# Altium schematic sheet IO.SchDoc: IO
size A4; Date: 31 08 2013; Author: Rachid AKKOUCHE; CompanyName: MDI; DrawnBy: Rachid AKKOUCHE; Engineer: Rachid AKKOUCHE; Organization: RASoftware; Address1: 52 J03, rue de la crèche; Address2: 77100 MEAUX; Address3: FRANCE; DocumentNumber: BRA2013090103C3; Revision: C; SheetNumber: 3; SheetTotal: 4; Telephone: +33651604047; Email: rachid.akkouche@wanadoo.fr; Dessinepar: -; Verifiepar: -; Property: RASoftware; PageSetup: Record=PageOptions|CenterHorizontal=True|CenterVertical=True|PrintScale=0.88|XCorrection=1.00|YCorrection=1.00|PrintKind=0|BorderSize=5000000|LeftOffset=0|BottomOffset=0|Orientation=2|PaperLength=1000|PaperWidth=1000|Scale=100|PaperSource=7|PrintQuality=-3|MediaType=1|DitherType=10|PrintScaleMode=1|PaperKind=16K|PaperIndex=409; Time: 13:22
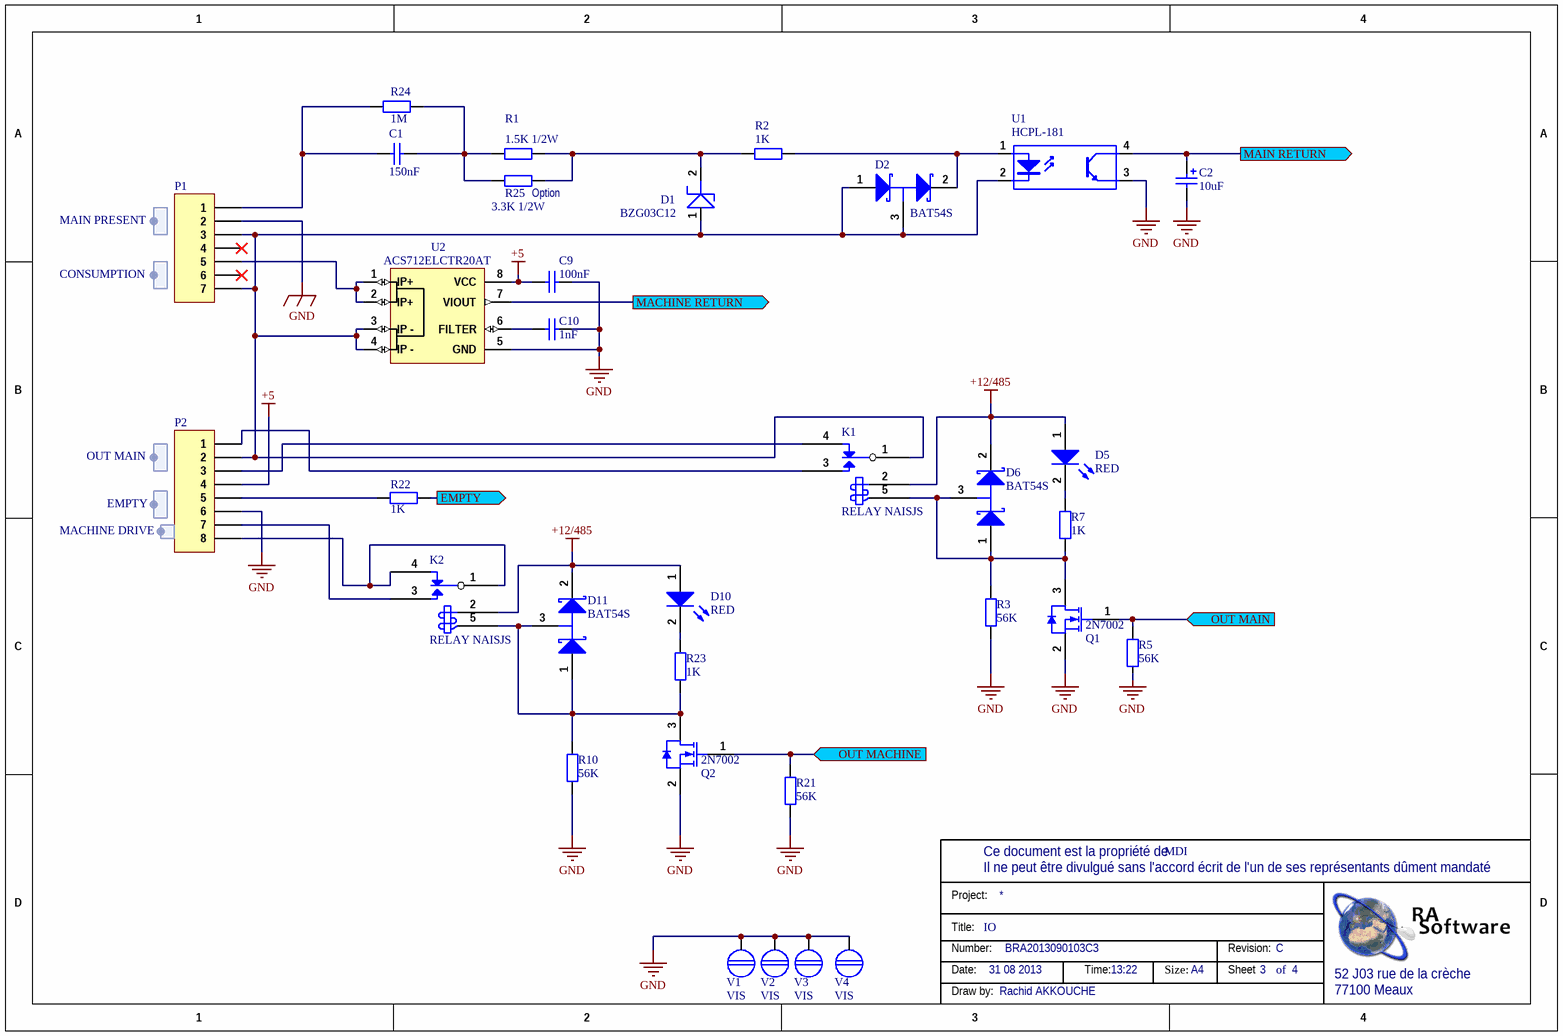
[diagram p0: IO.SchDoc]

## Parts
C1  150nF  [C1210]
C2  10uF  [C0805]
C9  100nF  [C0805]
C10  1nF  [C0805]
D1  BZG03C12  [sma]
D2  BAT54S  [SOT23]
D5  Couleur: RED  [0603-LEDR]  (hidden comment: HSMH-C190)
D6  BAT54S  [SOT23]
D10  Couleur: RED  [0603-LEDR]  (hidden comment: HSMH-C190)
D11  BAT54S  [SOT23]
K1  RELAY NAISJS  [RELAIG5L]
K2  RELAY NAISJS  [RELAIG5L]
P1  Header 7  [CO7P508-90]  (value not drawn)
P2  Header 8  [CO8P508 - 90°]  (value not drawn)
Q1  2N7002  [SOT23]
Q2  2N7002  [SOT23]
R1  1.5K 1/2W  [R1206]
R2  1K  [R0805]
R3  56K  [R0805]
R5  56K  [R0805]
R7  1K  [R0805]
R10  56K  [R0805]
R21  56K  [R0805]
R22  1K  [R0805]
R23  1K  [R0805]
R24  1M  [R0805]
R25  3.3K 1/2W  [R1206]  (no BOM)
U1  HCPL-181  [OPTO-4PIN]
U2  Supplier Part Number 1: ACS712ELCTR20AT  [SOIC8]  (hidden comment: ACS712)
V1  VIS  [vis42]
V2  VIS  [vis42]
V3  VIS  [vis42]
V4  VIS  [vis42]

## Ports
EMPTY (out), MACHINE RETURN (out), MAIN RETURN (out), OUT MACHINE (in), OUT MAIN (in)

## Harnesses
?: 

## Nets
+5: C9.2 P2.4 U2.8(VCC)
+12/485: D5.1(A) D6.2(K) D10.1(A) D11.2(K) K1.2(COIL1) K2.2(COIL1)
GND: C2.2 C9.1 C10.2 P1.2 P2.6 Q1.2(S) Q2.2(S) R3.1 R5.1 R10.1 R21.1 U1.3(E) U2.5(GND) V1.1 V2.1 V3.1 V4.1
EMPTY: R22.1 ; port EMPTY
MACHINE RETURN: U2.7(VIOUT) ; port MACHINE RETURN
MAIN RETURN: C2.1 U1.4(C) ; port MAIN RETURN
OUT MACHINE: Q2.1(G) R21.2 ; port OUT MACHINE
OUT MAIN: Q1.1(G) R5.2 ; port OUT MAIN
NetC1_1: C1.1 P1.1 R24.2
NetC1_2: C1.2 R1.2 R24.1 R25.2
NetC10_1: C10.1 U2.6(FILTER)
NetD1_1: D1.1 D2.1(A) D2.3(C) K1.1(COMMON) P1.3 P1.7 P2.2 U1.2(K) U2.3(IP_-) U2.4(IP_-)
NetD1_2: D1.2 R1.1 R2.1 R25.1
NetD2_2: D2.2(K) R2.2 U1.1(A)
NetD5_2: D5.2(K) R7.2
NetD6_1: D6.1(A) D6.3(C) K1.5(COIL2) Q1.3(D) R3.2 R7.1
NetD10_2: D10.2(K) R23.2
NetD11_1: D11.1(A) D11.3(C) K2.5(COIL2) Q2.3(D) R10.2 R23.1
NetK1_3: K1.3(NO) P2.1
NetK1_4: K1.4(NC) P2.3
NetK2_1: K2.1(COMMON) K2.4(NC) P2.8
NetK2_3: K2.3(NO) P2.7
NetP1_5: P1.5 U2.1(IP+) U2.2(IP+)
NetP2_5: P2.5 R22.2

Not connected (* = marked no-connect by the designer): P1 4* 6*

## Notes on the sheet
- MAIN PRESENT
- (near R25) Option
- CONSUMPTION
- OUT MAIN
- EMPTY
- MACHINE DRIVE
- Ce document est la propriété de
- Project:
- Il ne peut être divulgué sans l'accord écrit de l'un de ses représentants dûment mandaté
- Title:
- Number:
- Date:
- Time:
- Size:
- A4
- Revision:
- Sheet
- of
- 52 J03 rue de la crèche
- Draw by:
- 77100 Meaux

## Library data of the parts
C1 = Cap: Capacitor; Manufacturer: KEMET; Manufacturer Part Number: C1210V154KCRACTU; Gamme de produit: KEMET - ArcShield V Series; Capacité: 0.15; Tolérance de capacité: ± 10%; Diélectrique: X7; Tension: 500; Boîtier de condensateur Céramique: 1210 [3225 Metric]; Température d'utilisation min: -55; Température de fonctionnement max..: 125; Type de packaging: Bande découpée; SVHC: No SVHC (16-Dec-2013); Bornes de condensateur: CMS; Température de fonctionnement: -55°C à +125; Type de boîtier de condensateur: 1210 [3225 Metric]<!--FANDB--><div class="features-and-benefits-container"></div>; Supplier 1: Farnell; Supplier Part Number 1: 2085200; RoHS: YES; Pricing 1: 10=0,34, 50=0,28, 100=0,154, 500=0,125, 2500=0,097 (EUR); MSL: MSL 1 - Illimité; Tolérance de capacité ±: ± 10%; ComponentLink1URL: http://www.farnell.com/datasheets/1698777.pdf; ComponentLink1Description: http://www.farnell.com/datasheets/1698777.pdf
C2 = Cap Pol 100uF: Polarized Capacitor; Manufacturer: EPCOS; Manufacturer Part Number: B41142A4107M; Product Range: EPCOS - B41142 Series; Capacité: 100; Tolérance de capacité: ± 20%; Tension: 16; Type de boîtier de condensateur: Radial Can - SMD; Diamètre: 6.3; Résistance, ESR: 0.16; Hauteur: 7.7; Courant d'ondulation c.a.: 300; Type de packaging: Cut Tape; Durée de vie @ température: 2000 heures @ 105; Température d'utilisation min: -55; Température de fonctionnement max..: 105; SVHC: No SVHC (19-Dec-2012); Impédance: 0.26; Température de fonctionnement: -55°C à +105; Température, ESR: 20; Type de boîtier: CMS; Supplier 1: Farnell; RoHS: YES; Pricing 1: 10=0,123, 50=0,095, 100=0,078, 250=0,07, 1000=0,062 (EUR); Courant d'ondulation c.a. à  100Hz: 300; Fréquence, impédance: 100; Longueur/hauteur: 7.7; Température, courant ondulatoire: 105; Température, impédance: 20; ComponentLink1URL: http://www.epcos.com/inf/20/30/db/alu_x/B41142.pdf; ComponentLink1Description: http://www.epcos.com/inf/20/30/db/alu_x/B41142.pdf; Supplier Part Number 1: 1735328
C9 = Cap 0805 100nF: Capacitor; Manufacturer: MULTICOMP; Manufacturer Part Number: MCCA000296; Supplier 1: Farnell; Supplier Part Number 1: 1759167; Pricing 1: 100=0,01, 500=0,008, 1000=0,006, 4000=0,005 (EUR); ComponentLink1URL: http://www.farnell.com/datasheets/1520827.pdf; ComponentLink1Description: http://www.farnell.com/datasheets/1520827.pdf
C10 = Cap 0805 1nF: Capacitor; Manufacturer: SAMSUNG; Manufacturer Part Number: CL05B102KB5NNNC; Unit: pcs; SuppliedAmount: 10000; MinAmount: 300; Multiples: 100; Type de condensateur: céramique; Tye de condensateur: MLCC; Tension de travail: 50V; Diélectrique: X7R; Tolérance: ±10%; Montage: SMD; Boîtier: 0402; Température de travail: -55...125°C; Supplier 1: TME; Category: Condensateurs MLCC SMD 0402; Stock 1: 25000; Pricing 1: 300=0,00208, 1000=0,00124, 10000=0,00069, 40000=0,00066, 100000=0,00064 (EUR); Weight: 0,012; Price Type: NET; Capacité: 1nF; Fabricant: SAMSUNG; ComponentLink1URL: http://www.tme.eu/fr/details/cl05b102kb5nnnc/condensateurs-mlcc-smd-0402/samsung/; ComponentLink1Description: http://www.tme.eu/fr/details/cl05b102kb5nnnc/condensateurs-mlcc-smd-0402/samsung/; Supplier Part Number 1: CL05B102KB5NNNC
D1 = DZ: Manufacturer: VISHAY; Manufacturer Part Number: BZG03C12TR3; Supplier 1: Farnell; Supplier Part Number 1: 9398090; RoHS: YES; Pricing 1: 5=0,62, 100=0,37, 1500=0,26, 3000=0,138, 7000=0,135, 30000=0,132, 30000=0,129 (EUR); ComponentLink1URL: http://www.farnell.com/datasheets/69906.pdf; ComponentLink1Description: http://www.farnell.com/datasheets/69906.pdf
D2 D6 D11 = BAT54S: Schottky Barrier Double Diode; Manufacturer: MULTICOMP; Courant, If moy.: 200; Tension, Vrrm: 30; Tension, Vf max..: 400; Temps trr max.: 5; Courant, Ifs max.: 600; Type de boîtier diode: SOT-23; Nombre de broches: 3; SVHC: No SVHC (19-Dec-2012); Configuration diode: Dual Series; Température, Tj max..: 150; Type de terminaison: SMD; Température d'utilisation min: -55; Courant, If, Vf: 10; Courant, Ir, max..: 2; Marquage, CMS: L44; Température de fonctionnement: -55°C à +150; Supplier 1: Farnell; Supplier Part Number 1: 1621835; Manufacturer Part Number: BAT54S; RoHS: YES; Stock 1: 52055; Pricing 1: 10=0,102, 250=0,074, 1000=0,06, 3000=0,053 (EUR); Diode Type: Schottky; Type de boîtier: SOT-23; courant Ifsm: 600; ComponentLink1URL: http://www.farnell.com/datasheets/1317753.pdf; ComponentLink1Description: http://www.farnell.com/datasheets/1317753.pdf; Température de fonctionnement max..: 150
D5 D10 = HSMH-C190: Surface Mount Chip LED, Red; Manufacturer: AVAGO TECHNOLOGIES; Manufacturer Part Number: HSMH-C190.; Taille de lampe: 0.8mm x 1; Couleur de LED: Rouge; Intensité lumineuse: 17; Angle, vision: 170°; Courant, direct, If: 20; Tension, direct à  If: 1.8; Montage LED: CMS; Forme de lentille: Rectangulaire; Longueur d'onde typ.: 626; SVHC: No SVHC (19-Dec-2012); Dissipation de puissance: 65; Intensité lumineuse min. à  If: 2.8; Intensité lumineuse typique: 10; Largeur (externe): 0.8; Longueur d'onde dominante: 639; Longueur d'onde, crête: 630; Longueur/hauteur: 1.6; Matière: AlGaAs; Nombre de broches: 2; Orientation de montage opto: Dessus; Orientation sortie de lumière: Top Emitting; Température de fonctionnement: -30°C à +85; Température de fonctionnement max..: 85; Température, stockage min.: -40; Température d'utilisation min: -30; Tension, Vf max..: 2.6; Tension, Vf min.: 2.1; Type de LED: Standard; Supplier 1: Farnell; Supplier Part Number 1: 8554641; RoHS: YES; Pricing 1: 5=0,06, 25=0,059, 100=0,057, 250=0,052, 500=0,047 (EUR); MSL: MSL 2A - 4 semaines; Couleur, LED: Rouge; Profondeur: 0.8; Température, stockage max..: 85; Tension, Vf typ.: 1.8; ComponentLink1URL: http://www.farnell.com/datasheets/313031.pdf; ComponentLink1Description: http://www.farnell.com/datasheets/313031.pdf; ComponentLink2URL: http://www.farnell.com/datasheets/55927.pdf; ComponentLink2Description: http://www.farnell.com/datasheets/55927.pdf
K1 K2 = RELAY NAISJS: Manufacturer: OMRON ELECTRONIC COMPONENTS; Manufacturer Part Number: G5LA1A412DC; Type de relais: Puissance; Tension, bobine c.c. nom.: 12; Courant de contact max..: 10; Tension AC nominale du contact: 250; Tension DC nominale du contact: 24; Résistance, bobine: 400; Configuration des contacts: SPST-NO; Type de bobine: CC; Courant de bobine: 30; Puissance de fonctionnement nominale: 360; Montage relais: Traversant; Largeur (externe): 15.8; Profondeur: 19.8; SVHC: No SVHC (20-Jun-2013); Supplier 1: Farnell; Supplier Part Number 1: 2213790; RoHS: YES; Pricing 1: 1=0,84, 10=0,74, 50=0,66, 100=0,59, 250=0,54 (EUR); Hauteur, dimension externe: 15.8; ComponentLink1URL: http://www.farnell.com/datasheets/1648381.pdf; ComponentLink1Description: http://www.farnell.com/datasheets/1648381.pdf
P1 = Header 7: Header, 7-Pin; Manufacturer: FCI; Manufacturer Part Number: 20020110-H071A01LF; Anschlussart: Löten; Anzahl der Kontakte: 7; Anzahl der Reihen: 1; Betriebsspannung: 300 V ac; Breite: 12mm; Farbe: Grün; Gehäuseausrichtung: Rechtwinklig; Gender: Male; Länge: 37.56mm; Montagetyp: Durchsteckmontage; Nennstrom: 12A; Raster: 5.08mm; Serie: 06-508; Tiefe: 8.5mm; Typ: Stiftsockel; Currency: ÿNILÿ; Product StockNumber: 707-5477; Connecteur femelle: 790-0714; LatestRevisionDate: 17-Jul-2002; LatestRevisionNote: Re-released for DXP Platform.; Publisher: Altium Limited; Supplier 1: RS-Components; Supplier Part Number 1: 707-5477; RoHS: Compliant; Category: Steckverbinder; Stock 1: 0; Pricing 1: 5=0,778, 375=0,682, 1250=0,584, 2500=0,486, 5000=0,39 (ÿNILÿ); Material: Nylon; Product Status: ÿNILÿ; Future Stock Date: ÿNILÿ
P2 = Header 8: Header, 8-Pin; Manufacturer: CAMDENBOSS; Manufacturer Part Number: CTB9350/8AO; Gamme de produit: CAMDENBOSS - CTB9350; Type de terminaison de contact: Traversant; Genre: Mâle; Nombre de contacts: 8; Nombre de rangées: 1; Pas: 5; Plaquage du contact: Cuivre; Matériau du contact: Laiton; SVHC: No SVHC (16-Jun-2014); Couleur: vert; Courant: 12; Inflammabilité: UL94V-0; Matériau, vis: Acier; Méthode de terminaison: A souder; Taille du filetage: M3; Température de fonctionnement max..: 125; Température d'utilisation min: -20; Tension nominale Vac: 380; Terminaison du contact: Traversant à angle droit<!--FANDB--><div class="features-and-benefits-container"></div>; Connecteur femelle: 3881891; LatestRevisionDate: 17-Jul-2002; LatestRevisionNote: Re-released for DXP Platform.; Publisher: Altium Limited; Supplier 1: Farnell; Supplier Part Number 1: 3882251; RoHS: YES; Pricing 1: 1=0,963, 25=0,847, 100=0,793, 250=0,732, 700=0,659, 3000=0,581, 3000=0,523, 20000=0,471 (EUR); ComponentLink1URL: http://www.farnell.com/datasheets/1708040.pdf; ComponentLink1Description: http://www.farnell.com/datasheets/1708040.pdf
Q1 Q2 = 2N7002: N-channel Enhancement Mode Field-effect Transistor; Manufacturer: FAIRCHILD SEMICONDUCTOR; Supplier 1: Farnell; Supplier Part Number 1: 9845313; Manufacturer Part Number: 2N7002; RoHS: YES; Pricing 1: 5=0,138, 25=0,13, 100=0,059, 1000=0,049, 3000=0,026, 6000=0,0234 (EUR); ComponentLink1URL: http://www.farnell.com/datasheets/660093.pdf; ComponentLink1Description: http://www.farnell.com/datasheets/660093.pdf; ComponentLink2URL: http://www.farnell.com/datasheets/410597.pdf; ComponentLink2Description: http://www.farnell.com/datasheets/410597.pdf
R1 R25 = Resistor 0805 470: Resistor; Manufacturer: WALSIN; Manufacturer Part Number: WF12P3301FTL; Supplier 1: Farnell; Supplier Part Number 1: 2669101; RoHS: YES; Pricing 1: 5000=0.0099, 25000=0.0088, 50000=0.0079 (EUR); ComponentLink1URL: http://www.farnell.com/datasheets/1960321.pdf; ComponentLink1Description: http://www.farnell.com/datasheets/1960321.pdf
R2 = Res2: Resistor; Manufacturer: MULTICOMP; Manufacturer Part Number: MC0.1W08051%1KFR; Product Range: MULTICOMP - MC Series; Résistance: 1; Puissance: 100; Tolérance de résistance: ± 1%; Type de boîtier de résistance: 0805; Type de résistance: Couche épaisse; Coefficient de température: ± 100; Tension: 150; Type de packaging: Full Reel; Resistor Mounting: CMS; Supplier 1: Farnell; Supplier Part Number 1: 2129113; RoHS: YES; Stock 1: 599995; Pricing 1: 5000=0,001 (EUR); MSL: MSL 1 - Illimité; ComponentLink1URL: http://www.farnell.com/datasheets/1636796.pdf; ComponentLink1Description: http://www.farnell.com/datasheets/1636796.pdf
R3 R5 R10 R21 = Resistor 0805 56K: Resistor; Manufacturer: MULTICOMP; Manufacturer Part Number: MC0.1W08051%56KFR; Product Range: MULTICOMP - MC Series; Résistance: 56; Puissance: 100; Tolérance de résistance: ± 1%; Type de boîtier de résistance: 0805; Type de résistance: Couche épaisse; Coefficient de température: ± 100; Tension: 150; Type de packaging: Full Reel; Resistor Mounting: CMS; Resistor Terminals: (Non Disponible); Supplier 1: Farnell; RoHS: YES; Pricing 1: 5000=0,001 (EUR); MSL: (Non Applicable); ComponentLink1URL: http://www.farnell.com/datasheets/1716700.pdf; ComponentLink1Description: http://www.farnell.com/datasheets/1716700.pdf; Supplier Part Number 1: 2129258
R7 R22 R23 = Resistor 0805 1K: Resistor; Manufacturer: MULTICOMP; Manufacturer Part Number: MC0.1W08051%1KFR; Product Range: MULTICOMP - MC Series; Résistance: 1; Puissance: 100; Tolérance de résistance: ± 1%; Type de boîtier de résistance: 0805; Type de résistance: Couche épaisse; Coefficient de température: ± 100; Tension: 150; Type de packaging: Full Reel; Resistor Mounting: CMS; Supplier 1: Farnell; RoHS: YES; Pricing 1: 5000=0,001 (EUR); MSL: MSL 1 - Illimité; ComponentLink1URL: http://www.farnell.com/datasheets/1716700.pdf; ComponentLink1Description: http://www.farnell.com/datasheets/1716700.pdf; Supplier Part Number 1: 2129113
R24 = Resistor 0805 470: Resistor; Manufacturer: MULTICOMP; Manufacturer Part Number: MCWR08X1004FTL; Gamme de produit: MULTICOMP - MCWR Series; Résistance: 1; Puissance: 125; Tolérance de résistance: ± 1%; Type de boîtier de résistance: 0805 [2012 Metric]; Type de résistance: Couche épaisse; Coefficient de température: ± 100; Tension: 150; Type de packaging: Bande et Bobine; Supplier 1: Farnell; Supplier Part Number 1: 2446913; RoHS: YES; Stock 1: 119995; Pricing 1: 5000=0,0006 (EUR); MSL: -<!--FANDB--><div class="features-and-benefits-container"></div>; ComponentLink1URL: http://www.farnell.com/datasheets/1849611.pdf; ComponentLink1Description: http://www.farnell.com/datasheets/1849611.pdf
U1 = Optoisolator1: 4-Pin Phototransistor Optocoupler; Manufacturer: AVAGO TECHNOLOGIES; Manufacturer Part Number: HCPL-181-00AE; Supplier 1: Farnell; Supplier Part Number 1: 1244526RL; RoHS: YES; Pricing 1: 150=0,27, 250=0,217, 500=0,191, 2000=0,143, 2000=0,14, 20000=0,137 (EUR); ComponentLink1URL: http://www.farnell.com/datasheets/317140.pdf; ComponentLink1Description: http://www.farnell.com/datasheets/317140.pdf
U2 = ACS712: HALL EFFECT CURRENT SENSOR; Manufacturer: ALLEGRO MICROSYSTEMS; Manufacturer Part Number: ACS712ELCTR-20A-T; Unit: pcs; SuppliedAmount: 10; MinAmount: 1; Type de capteur: Hall effet; Tension d'alimentation: 8V DC; Courant d'entrée: ± 20A; Température de travail: -40...85°C; Supplier 1: TME; Category: Capteurs de Hall; Stock 1: 844; Pricing 1: 1=3,39, 3=3,16, 10=2,92 (EUR); Weight: 0,336; Multiples: 1; Price Type: NET; Fabricant: ALLEGRO MICROSYSTEMS; ComponentLink1URL: http://www.tme.eu/fr/details/acs712elctr20at/capteurs-de-hall/allegro-microsystems/acs712elctr-20a-t/; ComponentLink1Description: http://www.tme.eu/fr/details/acs712elctr20at/capteurs-de-hall/allegro-microsystems/acs712elctr-20a-t/